# EAGLE schematic MCP23017_O8_v1_0 (EAGLE 9.6.2)
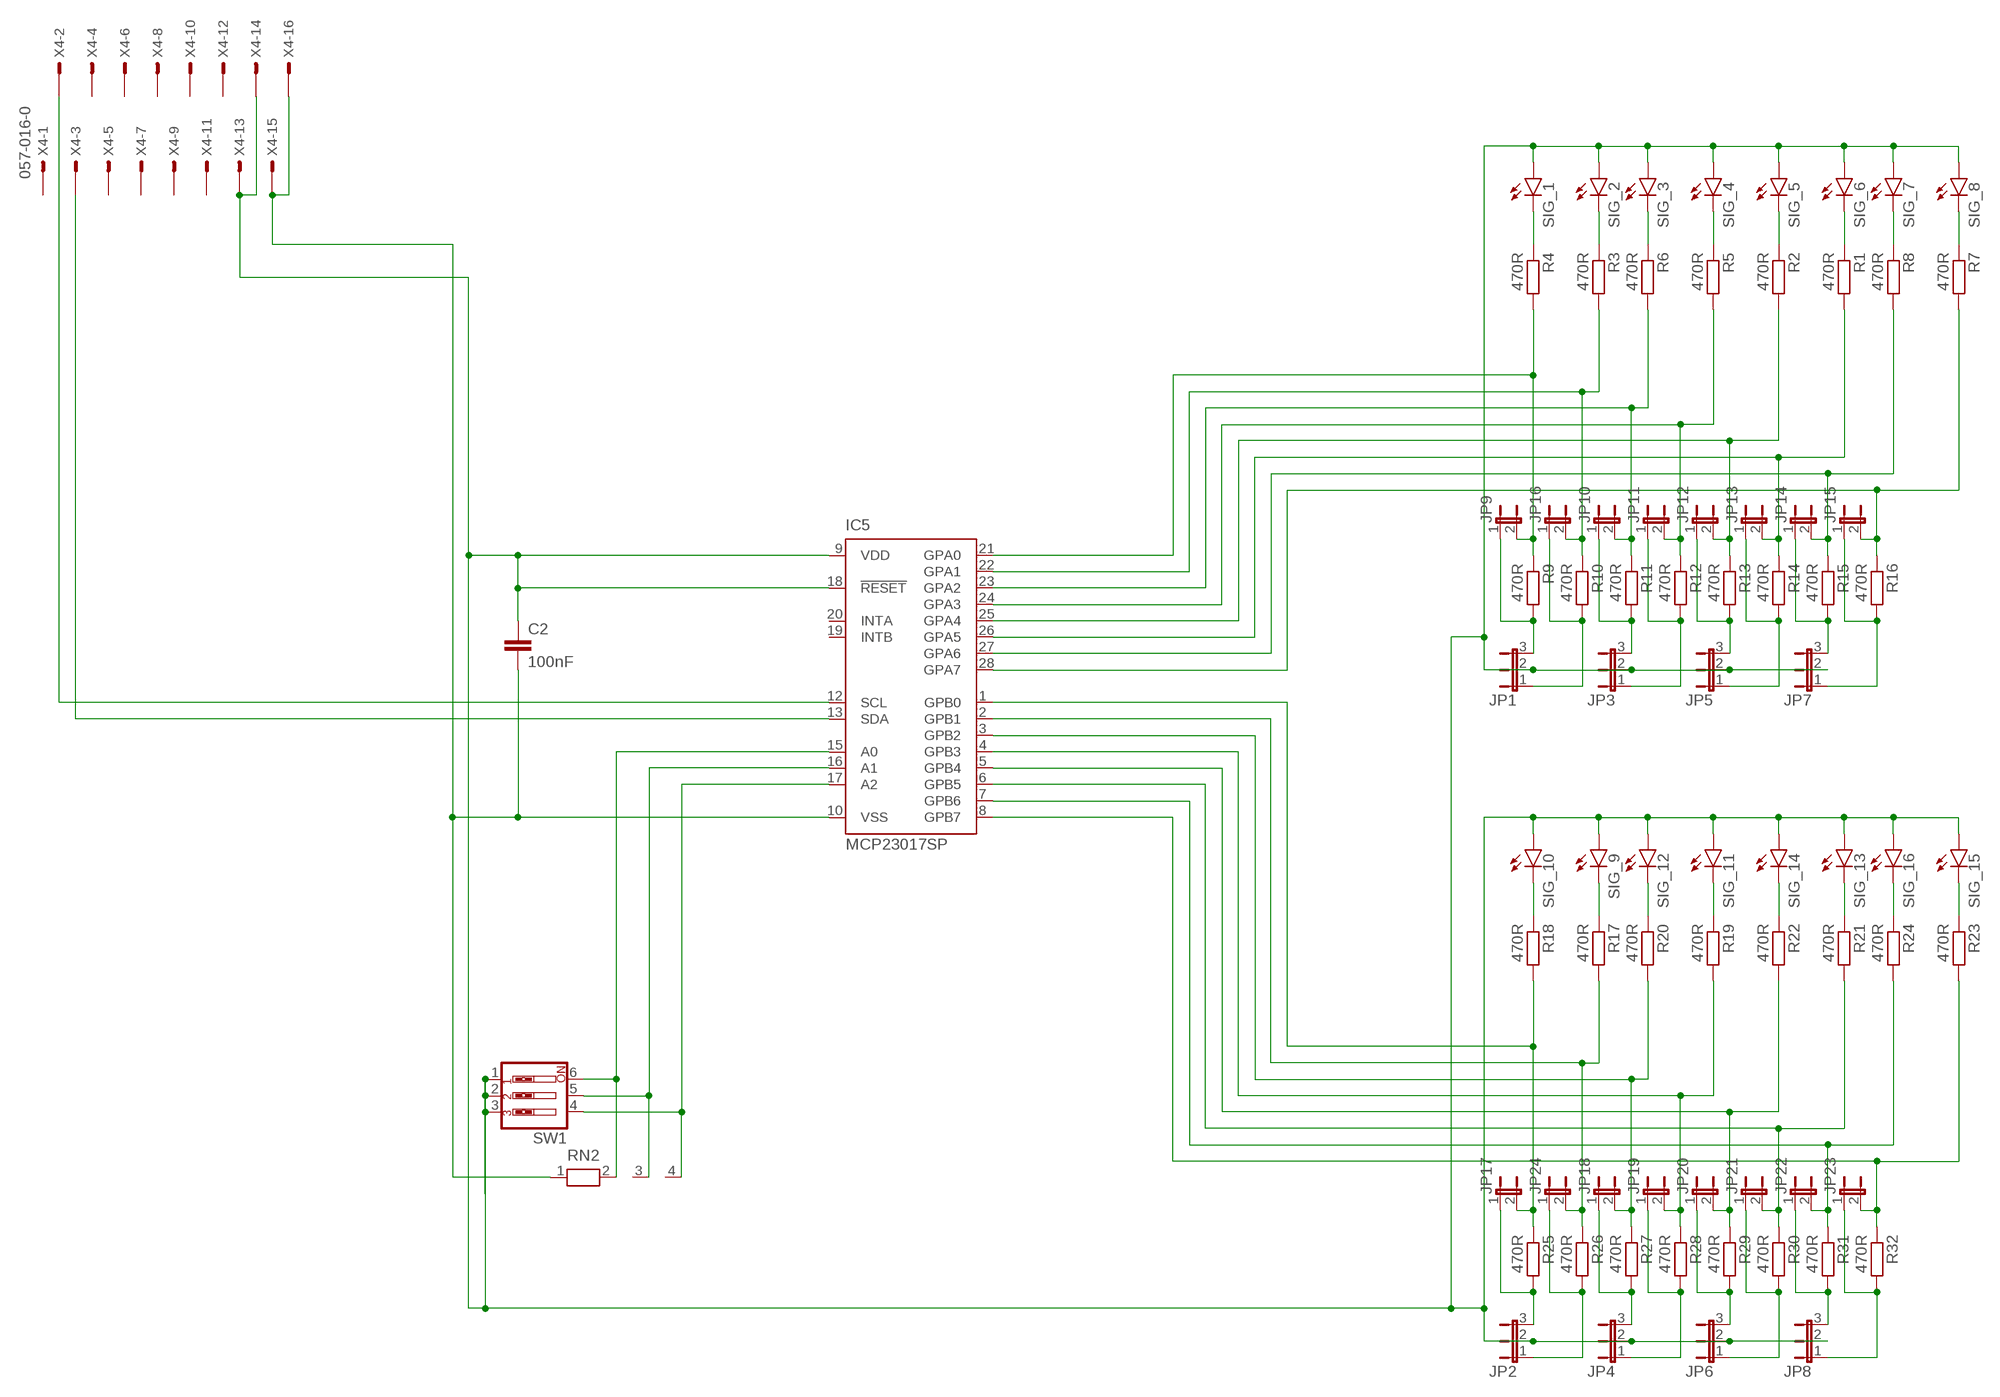
[diagram p0: schematic, sheet 1]

## Parts
C2  100nF  C-EU025-024X044  [C025-024X044]
IC5  MCP23017SP  [DIL28-3]
JP1  JP2E  [JP2]
JP2  JP2E  [JP2]
JP3  JP2E  [JP2]
JP4  JP2E  [JP2]
JP5  JP2E  [JP2]
JP6  JP2E  [JP2]
JP7  JP2E  [JP2]
JP8  JP2E  [JP2]
JP9  JP1E  [JP1]
JP10  JP1E  [JP1]
JP11  JP1E  [JP1]
JP12  JP1E  [JP1]
JP13  JP1E  [JP1]
JP14  JP1E  [JP1]
JP15  JP1E  [JP1]
JP16  JP1E  [JP1]
JP17  JP1E  [JP1]
JP18  JP1E  [JP1]
JP19  JP1E  [JP1]
JP20  JP1E  [JP1]
JP21  JP1E  [JP1]
JP22  JP1E  [JP1]
JP23  JP1E  [JP1]
JP24  JP1E  [JP1]
R1  470R  R-EU_0309/10  [0309/10]
R2  470R  R-EU_0309/10  [0309/10]
R3  470R  R-EU_0309/10  [0309/10]
R4  470R  R-EU_0309/10  [0309/10]
R5  470R  R-EU_0309/10  [0309/10]
R6  470R  R-EU_0309/10  [0309/10]
R7  470R  R-EU_0309/10  [0309/10]
R8  470R  R-EU_0309/10  [0309/10]
R9  470R  R-EU_0309/10  [0309/10]
R10  470R  R-EU_0309/10  [0309/10]
R11  470R  R-EU_0309/10  [0309/10]
R12  470R  R-EU_0309/10  [0309/10]
R13  470R  R-EU_0309/10  [0309/10]
R14  470R  R-EU_0309/10  [0309/10]
R15  470R  R-EU_0309/10  [0309/10]
R16  470R  R-EU_0309/10  [0309/10]
R17  470R  R-EU_0309/10  [0309/10]
R18  470R  R-EU_0309/10  [0309/10]
R19  470R  R-EU_0309/10  [0309/10]
R20  470R  R-EU_0309/10  [0309/10]
R21  470R  R-EU_0309/10  [0309/10]
R22  470R  R-EU_0309/10  [0309/10]
R23  470R  R-EU_0309/10  [0309/10]
R24  470R  R-EU_0309/10  [0309/10]
R25  470R  R-EU_0309/10  [0309/10]
R26  470R  R-EU_0309/10  [0309/10]
R27  470R  R-EU_0309/10  [0309/10]
R28  470R  R-EU_0309/10  [0309/10]
R29  470R  R-EU_0309/10  [0309/10]
R30  470R  R-EU_0309/10  [0309/10]
R31  470R  R-EU_0309/10  [0309/10]
R32  470R  R-EU_0309/10  [0309/10]
RN2  RN03  [RN-3]
SIG_1  LED3MM  [LED3MM]
SIG_2  LED3MM  [LED3MM]
SIG_3  LED3MM  [LED3MM]
SIG_4  LED3MM  [LED3MM]
SIG_5  LED3MM  [LED3MM]
SIG_6  LED3MM  [LED3MM]
SIG_7  LED3MM  [LED3MM]
SIG_8  LED3MM  [LED3MM]
SIG_9  LED3MM  [LED3MM]
SIG_10  LED3MM  [LED3MM]
SIG_11  LED3MM  [LED3MM]
SIG_12  LED3MM  [LED3MM]
SIG_13  LED3MM  [LED3MM]
SIG_14  LED3MM  [LED3MM]
SIG_15  LED3MM  [LED3MM]
SIG_16  LED3MM  [LED3MM]
SW1  SW_DIP-3  [EDG-03]
X4  057-016-0  [057-016-0]

## Nets
GND2: C2.2 IC5.10(VSS) RN2.1 X4.15 X4.16
N$1: JP1.3 JP9.1 R9.2
N$3: R2.1 SIG_5.K(C)
N$4: R1.1 SIG_6.K(C)
N$5: IC5.27(GPA6) JP14.2 R8.2 R15.1
N$6: IC5.17(A2) RN2.4 SW1.4
N$7: R8.1 SIG_7.K(C)
N$8: R7.1 SIG_8.K(C)
N$9: JP1.1 JP16.1 R10.2
N$10: JP3.3 JP10.1 R11.2
N$11: JP3.1 JP11.1 R12.2
N$13: JP5.3 JP12.1 R13.2
N$22: IC5.22(GPA1) JP16.2 R3.2 R10.1
N$24: IC5.24(GPA3) JP11.2 R5.2 R12.1
N$26: IC5.26(GPA5) JP13.2 R1.2 R14.1
N$28: IC5.28(GPA7) JP15.2 R7.2 R16.1
N$29: IC5.21(GPA0) JP9.2 R4.2 R9.1
N$30: JP5.1 JP13.1 R14.2
N$32: JP7.3 JP14.1 R15.2
N$33: JP7.1 JP15.1 R16.2
N$35: IC5.16(A1) RN2.3 SW1.5
N$36: R4.1 SIG_1.K(C)
N$37: R3.1 SIG_2.K(C)
N$41: IC5.23(GPA2) JP10.2 R6.2 R11.1
N$43: IC5.25(GPA4) JP12.2 R2.2 R13.1
N$49: IC5.1(GPB0) JP17.2 R18.2 R25.1
N$51: IC5.3(GPB2) JP18.2 R20.2 R27.1
N$53: R6.1 SIG_3.K(C)
N$54: R5.1 SIG_4.K(C)
N$56: IC5.6(GPB5) JP21.2 R21.2 R30.1
N$58: IC5.8(GPB7) JP23.2 R23.2 R32.1
N$60: IC5.2(GPB1) JP24.2 R17.2 R26.1
N$61: R18.1 SIG_10.K(C)
N$62: R17.1 SIG_9.K(C)
N$64: IC5.4(GPB3) JP19.2 R19.2 R28.1
N$65: IC5.5(GPB4) JP20.2 R22.2 R29.1
N$66: R20.1 SIG_12.K(C)
N$67: R19.1 SIG_11.K(C)
N$69: R22.1 SIG_14.K(C)
N$70: R21.1 SIG_13.K(C)
N$71: IC5.7(GPB6) JP22.2 R24.2 R31.1
N$72: R24.1 SIG_16.K(C)
N$73: R23.1 SIG_15.K(C)
N$74: JP2.3 JP17.1 R25.2
N$75: JP2.1 JP24.1 R26.2
N$76: JP4.3 JP18.1 R27.2
N$77: JP4.1 JP19.1 R28.2
N$78: JP6.3 JP20.1 R29.2
N$79: JP6.1 JP21.1 R30.2
N$80: JP8.3 JP22.1 R31.2
N$81: JP8.1 JP23.1 R32.2
N$82: IC5.12(SCL) X4.2
N$84: IC5.13(SDA) X4.3
N$85: IC5.15(A0) RN2.2 SW1.6
VCC5.1: C2.1 IC5.9(VDD) IC5.18(!RESET) JP1.2 JP2.2 JP3.2 JP4.2 JP5.2 JP6.2 JP7.2 JP8.2 SIG_1.A SIG_2.A SIG_3.A SIG_4.A SIG_5.A SIG_6.A SIG_7.A SIG_8.A SIG_9.A SIG_10.A SIG_11.A SIG_12.A SIG_13.A SIG_14.A SIG_15.A SIG_16.A SW1.1 SW1.2 SW1.3 X4.13 X4.14
Unconnected: IC5.19(INTB) IC5.20(INTA) X4.1 X4.4 X4.5 X4.6 X4.7 X4.8 X4.9 X4.10 X4.11 X4.12

## Library data of the parts
C2 = resistor:C-EU: CAPACITOR, European symbol
IC5 = microchip-6:MCP23017: http://ww1.microchip.com/downloads/en/DeviceDoc/21952a.pdf Source: http://ww1.microchip.com/downloads/en/DeviceDoc/21952a.pdf
JP1-JP8 = jumper:JP2E: JUMPER
JP9-JP24 = jumper:JP1E: JUMPER
R1-R32 = resistor:R-EU_: RESISTOR, European symbol
RN2 = resistor-net_edit:RN03: RESISTOR NETWORK; OC_FARNELL: unknown; OC_NEWARK: unknown
SIG_1-SIG_16 = led:LED: LED OSRAM: - CHIPLED LG R971, LG N971, LY N971, LG Q971, LY Q971, LO R971, LY R971 LH N974, LH R974 LS Q976, LO Q976, LY Q976 LO Q996 - Hyper CHIPLED LW Q18S LB Q993, LB Q99A, LB R99A - SideLED LS A670, LO A670, LY A670, LG A670, LP A670 LB A673, LV A673, LT A673, LW A673 LH A674 LY A675 LS A676, LA A676, LO A676, LY A676, LW A676 LS A679, LY A679, LG A679 - Hyper Micro SIDELED® LS Y876, LA Y876, LO Y876, LY Y876 LT Y87S - SmartLED LW L88C, LW L88S LB L89C, LB L89S, LG L890 LS L89K, LO L89K, LY L89K LS L896, LA L896, LO L896, LY L896 - TOPLED LS T670, LO T670, LY T670, LG T670, LP T670 LSG T670, LSP T670, LSY T670, LOP T670, LYG T670 LG T671, LOG T671, LSG T671 LB T673, LV T673, LT T673, LW T673 LH T674 LS T676, LA T676, LO T676, LY T676, LB T676, LH T676, LSB T676, LW T676 LB T67C, LV T67C, LT T67C, LS T67K, LO T67K, LY T67K, LW E67C LS E67B, LA E67B, LO E67B, LY E67B, LB E67C, LV E67C, LT E67C LW T67C LS T679, LY T679, LG T679 LS T770, LO T770, LY T770, LG T770, LP T770 LB T773, LV T773, LT T773, LW T773 LH T774 LS E675, LA E675, LY E675, LS T675 LS T776, LA T776, LO T776, LY T776, LB T776 LHGB T686 LT T68C, LB T68C - Hyper Mini TOPLED® LB M676 - Mini TOPLED Santana® LG M470 LS M47K, LO M47K, LY M47K Source: http://www.osram.convergy.de LUXEON: - LUMILED® LXK2-PW12-R00, LXK2-PW12-S00, LXK2-PW14-U00, LXK2-PW14-V00 LXK2-PM12-R00, LXK2-PM12-S00, LXK2-PM14-U00 LXK2-PE12-Q00, LXK2-PE12-R00, LXK2-PE12-S00, LXK2-PE14-T00, LXK2-PE14-U00 LXK2-PB12-K00, LXK2-PB12-L00, LXK2-PB12-M00, LXK2-PB14-N00, LXK2-PB14-P00, LXK2-PB14-Q00 LXK2-PR12-L00, LXK2-PR12-M00, LXK2-PR14-Q00, LXK2-PR14-R00 LXK2-PD12-Q00, LXK2-PD12-R00, LXK2-PD12-S00 LXK2-PH12-R00, LXK2-PH12-S00 LXK2-PL12-P00, LXK2-PL12-Q00, LXK2-PL12-R00 Source: www.luxeon.com KINGBRIGHT: KA-3528ASYC Source: www.kingbright.com
SW1 = special:SW_DIP-3: DIP SWITCH
X4 = con-panduit:057-016-: CONNECTOR 10-pin series 057 contact pc board low profile headers; OC_FARNELL: unknown; OC_NEWARK: unknown